# Altium schematic sheet RPi_connector.SchDoc
size A4; SheetNumber: 3; SheetTotal: 12
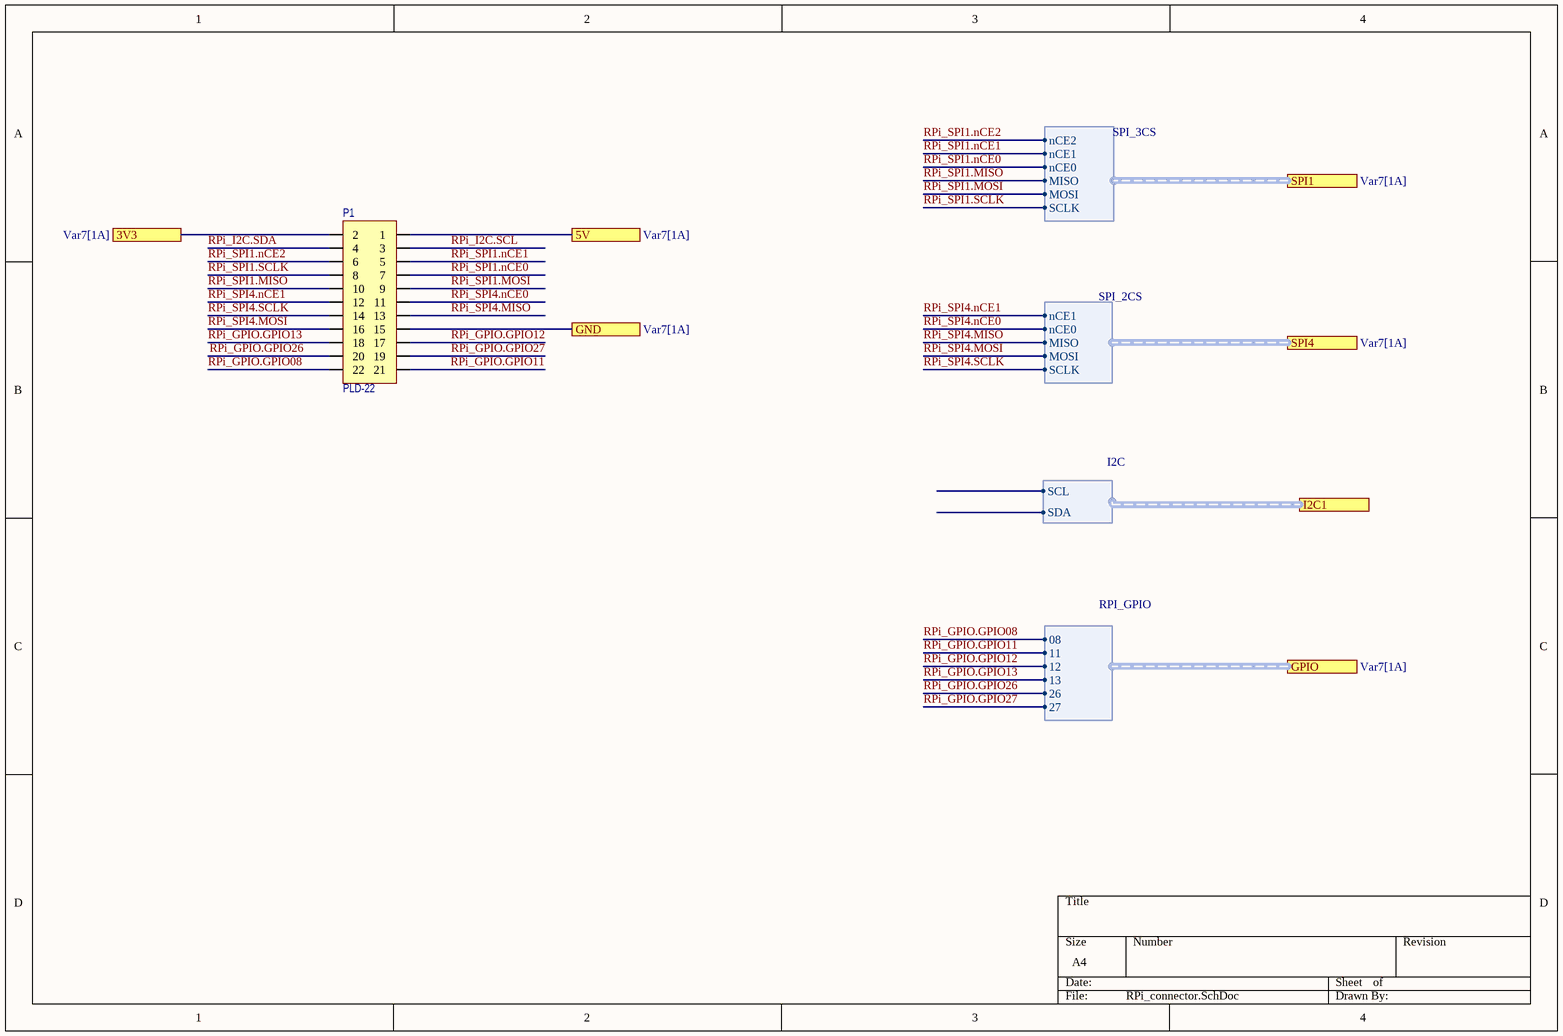
[diagram p0: RPi_connector.SchDoc]

## Parts
P1  PLD-22  [PLD-22]

## Ports
3V3 (see Var7[1A]), 5V (see Var7[1A]), GND (see Var7[1A]), GPIO (harness RPI_GPIO, see Var7[1A]), I2C1 (harness I2C), SPI1 (harness SPI_3CS, see Var7[1A]), SPI4 (harness SPI_2CS, see Var7[1A])

## Harnesses
RPI_GPIO: 08, 11, 26, 27, 12, 13
SPI_2CS: nCE1, nCE0, MISO, MOSI, SCLK
SPI_3CS: MISO, MOSI, nCE0, nCE1, nCE2, SCLK
I2C: SCL, SDA

## Nets
3V3: P1.2 ; port 3V3
5V: P1.1 ; port 5V
GND: P1.15 ; port GND
RPi_GPIO.GPIO08: P1.22 ; port GPIO.08
RPi_GPIO.GPIO11: P1.21 ; port GPIO.11
RPi_GPIO.GPIO12: P1.17 ; port GPIO.12
RPi_GPIO.GPIO13: P1.18 ; port GPIO.13
RPi_GPIO.GPIO26: P1.20 ; port GPIO.26
RPi_GPIO.GPIO27: P1.19 ; port GPIO.27
RPi_I2C.SCL: P1.3
RPi_I2C.SDA: P1.4
RPi_SPI1.MISO: P1.10 ; port SPI1.MISO
RPi_SPI1.MOSI: P1.9 ; port SPI1.MOSI
RPi_SPI1.nCE0: P1.7 ; port SPI1.nCE0
RPi_SPI1.nCE1: P1.5 ; port SPI1.nCE1
RPi_SPI1.nCE2: P1.6 ; port SPI1.nCE2
RPi_SPI1.SCLK: P1.8 ; port SPI1.SCLK
RPi_SPI4.MISO: P1.13 ; port SPI4.MISO
RPi_SPI4.MOSI: P1.16 ; port SPI4.MOSI
RPi_SPI4.nCE0: P1.11 ; port SPI4.nCE0
RPi_SPI4.nCE1: P1.12 ; port SPI4.nCE1
RPi_SPI4.SCLK: P1.14 ; port SPI4.SCLK